# Altium schematic sheet main.SchDoc
size A4
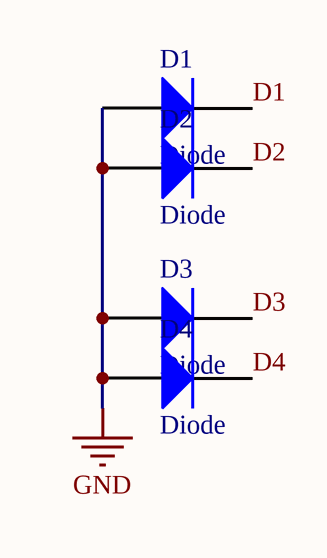
[diagram p0: main.SchDoc]

## Parts
D1  Diode  [PIN-diode]
D2  Diode  [PIN-diode]
D3  Diode  [PIN-diode]
D4  Diode  [PIN-diode]

## Nets
GND: D1.1(A) D2.1(A) D3.1(A) D4.1(A)
D1: D1.2(K)
D2: D2.2(K)
D3: D3.2(K)
D4: D4.2(K)

## Library data of the parts
D1-D4 = Diode: Default Diode; Published: 8-Jun-2000; LatestRevisionDate: 17-Jul-2002; LatestRevisionNote: Re-released for DXP Platform.; PackageVersion: Sep-1996; PackageReference: SMC; Publisher: Altium Limited; PackageDescription: DO-214-AB/SMC; 2 C-Bend Leads; Body 7.9 x 5.9 mm, inc. leads (LxW); Code_JEDEC: DO-214-AB